# Altium schematic sheet MCU - MKL05VQFN24.SchDoc
size A
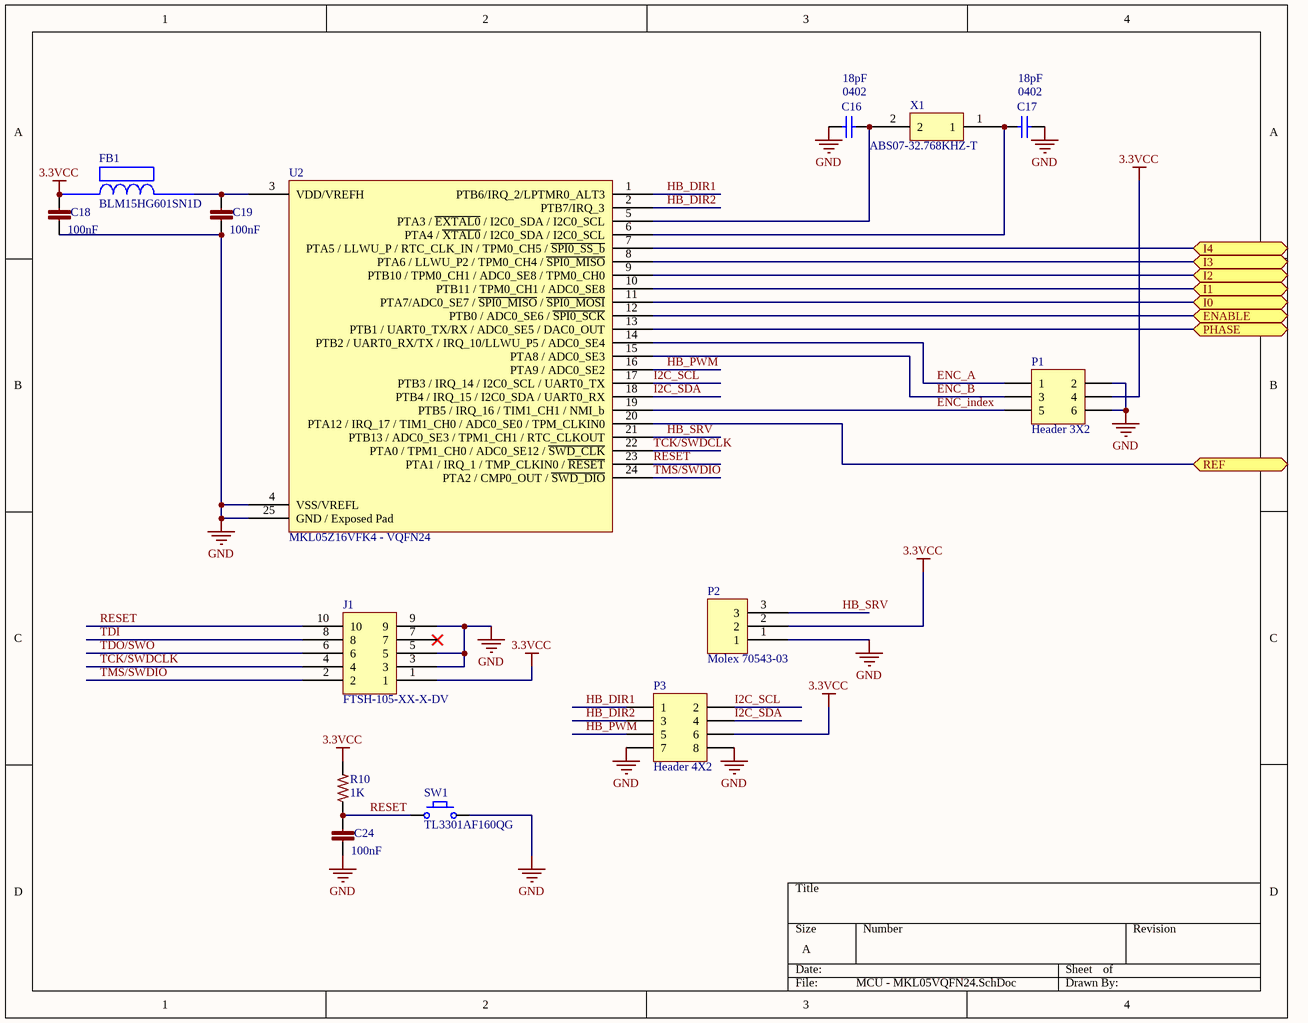
[diagram p0: MCU - MKL05VQFN24.SchDoc]

## Parts
C16  0402  value 18pF  [C0402]
C17  0402  value 18pF  [C0402]
C18  100nF  [C0402]
C19  100nF  [C0402]
C24  100nF  [C0402]
FB1  BLM15HG601SN1D  [BLM18PG121SN1D]
J1  FTSH-105-XX-X-DV  [FTSH-105-XX-X-DV]
P1  Header 3X2  [HDR2X3 Shrouded - Molex 0901301106]
P2  Molex 70543-03  [70543-03]
P3  Header 4X2  [HDR2X4 Shrouded]
R10  1K  [R0603]
SW1  TL3301AF160QG  [TL3301AF160QG]
U2  MKL05Z16VFK4 - VQFN24  [98ASA00474D]
X1  ABS07-32.768KHZ-T  [ABS07-32.768KHZ-T]

## Ports
ENABLE, I0, I1, I2, I3, I4, PHASE, REF

## Nets
3.3VCC: C18.1 FB1.1 J1.1 P1.4 P2.2 P3.6 R10.2
GND: C16.2 C17.1 C18.2 C19.2 C24.2 J1.3 J1.5 J1.9 P1.2 P1.6 P2.1 P3.7 P3.8 SW1.2 U2.4(VSS/VREFL) U2.25(GND_/_Exposed_Pad)
ENABLE: U2.12(PTB0_/_ADC0_SE6_/_~{SPI0_SCK}) ; port ENABLE
ENC_A: P1.1 U2.14(PTB2_/_UART0_RX/TX_/_IRQ_10/LLWU_P5_/_ADC0_SE4)
ENC_B: P1.3 U2.15(PTA8_/_ADC0_SE3)
ENC_index: P1.5 U2.19(PTB5_/_IRQ_16_/_TIM1_CH1_/_NMI_b)
HB_DIR1: P3.1 U2.1(PTB6/IRQ_2/LPTMR0_ALT3)
HB_DIR2: P3.3 U2.2(PTB7/IRQ_3)
HB_PWM: P3.5 U2.16(PTA9_/_ADC0_SE2)
HB_SRV: P2.3 U2.21(PTB13_/_ADC0_SE3_/_TPM1_CH1_/_RTC_CLKOUT)
I0: U2.11(PTA7/ADC0_SE7_/_~{SPI0_MISO}_/_~{SPI0_MOSI}) ; port I0
I1: U2.10(PTB11_/_TPM0_CH1_/_ADC0_SE8) ; port I1
I2: U2.9(PTB10_/_TPM0_CH1_/_ADC0_SE8_/_TPM0_CH0) ; port I2
I2C_SCL: P3.2 U2.17(PTB3_/_IRQ_14_/_I2C0_SCL_/_UART0_TX)
I2C_SDA: P3.4 U2.18(PTB4_/_IRQ_15_/_I2C0_SDA_/_UART0_RX)
I3: U2.8(PTA6_/_LLWU_P2_/_TPM0_CH4_/_~{SPI0_MISO}) ; port I3
I4: U2.7(PTA5_/_LLWU_P_/_RTC_CLK_IN_/_TPM0_CH5_/_~{SPI0_SS_b}) ; port I4
PHASE: U2.13(PTB1_/_UART0_TX/RX_/_ADC0_SE5_/_DAC0_OUT) ; port PHASE
REF: U2.20(PTA12_/_IRQ_17_/_TIM1_CH0_/_ADC0_SE0_/_TPM_CLKIN0) ; port REF
RESET: C24.1 J1.10 R10.1 SW1.1 U2.23(PTA1_/_IRQ_1_/_TMP_CLKIN0_/_~{RESET})
TCK/SWDCLK: J1.4 U2.22(PTA0_/_TPM1_CH0_/_ADC0_SE12_/_~{SWD_CLK})
TDI: J1.8
TDO/SWO: J1.6
TMS/SWDIO: J1.2 U2.24(PTA2_/_CMP0_OUT_/_~{SWD_DIO})
NetC16_1: C16.1 U2.5(PTA3_/_~{EXTAL0}_/_I2C0_SDA_/_I2C0_SCL) X1.2
NetC17_2: C17.2 U2.6(PTA4_/_~{XTAL0}_/_I2C0_SDA_/_I2C0_SCL) X1.1
NetC19_1: C19.1 FB1.2 U2.3(VDD/VREFH)

Not connected (* = marked no-connect by the designer): J1 7*

## Library data of the parts
C16 C17 = CL05C180GB5NNNC: CAP CER 18PF 50V 2% NP0 0402; Manufacturer: Samsung; Published: 10 - Dec - 2014; LatestRevisionDate: 10 - Dec - 2014; LatestRevisionNote: Ultimachine Footprint Added; Publisher: Ultimachine; Component Type: Chip Capacitor; Manufacture Part #: CL05C180GB5NNNC; Part Description: CAP CER 18PF 50V 2% NP0 0402; Mounting Type: SMT 0402; Datasheet: http://www.samsungsem.com/kr/front/downloadcms.do?path=/kr/support/product-search/mlcc/__icsFiles/afieldfile/2014/11/05&fileName=S_CL05C180GB5NNNC.pdf; Height: 0.25 ± 0.15mm; Tolerance: 2%; Voltage: 50V; PackageReference: 0402
C18 C19 C24 = GRM155R71C104KA88D: CAP CER 0402 100nF 16V 10% X7R; LastRevisionNote: ImportComponents; Published: 23-Apr-2014; Publisher: UltiMachine; LastRevisionDate: 23-Apr-2014; ManufacturerPartNumber: GRM155R71C104KA88D; VALUE: 100nF
J1 = ARM Cortex JTAG-DEBUG Header
P1 = Header 3X2: Header, 3-Pin, Dual row; LatestRevisionDate: 17-Jul-2002; LatestRevisionNote: Re-released for DXP Platform.; Publisher: Altium Limited
P2 = Molex Endstop
P3 = Header 4X2: Header, 4-Pin, Dual row; LatestRevisionDate: 17-Jul-2002; LatestRevisionNote: Re-released for DXP Platform.; Publisher: Altium Limited
R10 = ERJ-3EKF1001V: RES 0603 1K 100mW 1%; LastRevisionNote: ImportComponents; Published: 23-Apr-2014; Publisher: UltiMachine; LastRevisionDate: 23-Apr-2014; ManufacturerPartNumber: ERJ-3EKF1001V; VALUE: 1K
U2 = MKL05Z16VFK4 - 24 Pin VQFN: ARM Cortex M0+
X1 = ABS07-32.768KHZ-T: ABS07-32.768KHZ-T RTC Crystal Oscillator
SW1 = TL3301AF160QG: MFR: *; MFR#: TL3301AF160QG; Type: SMD Momentary Tactile Switch; Height: *